# Altium schematic sheet 5V输出.SchDoc
size A4
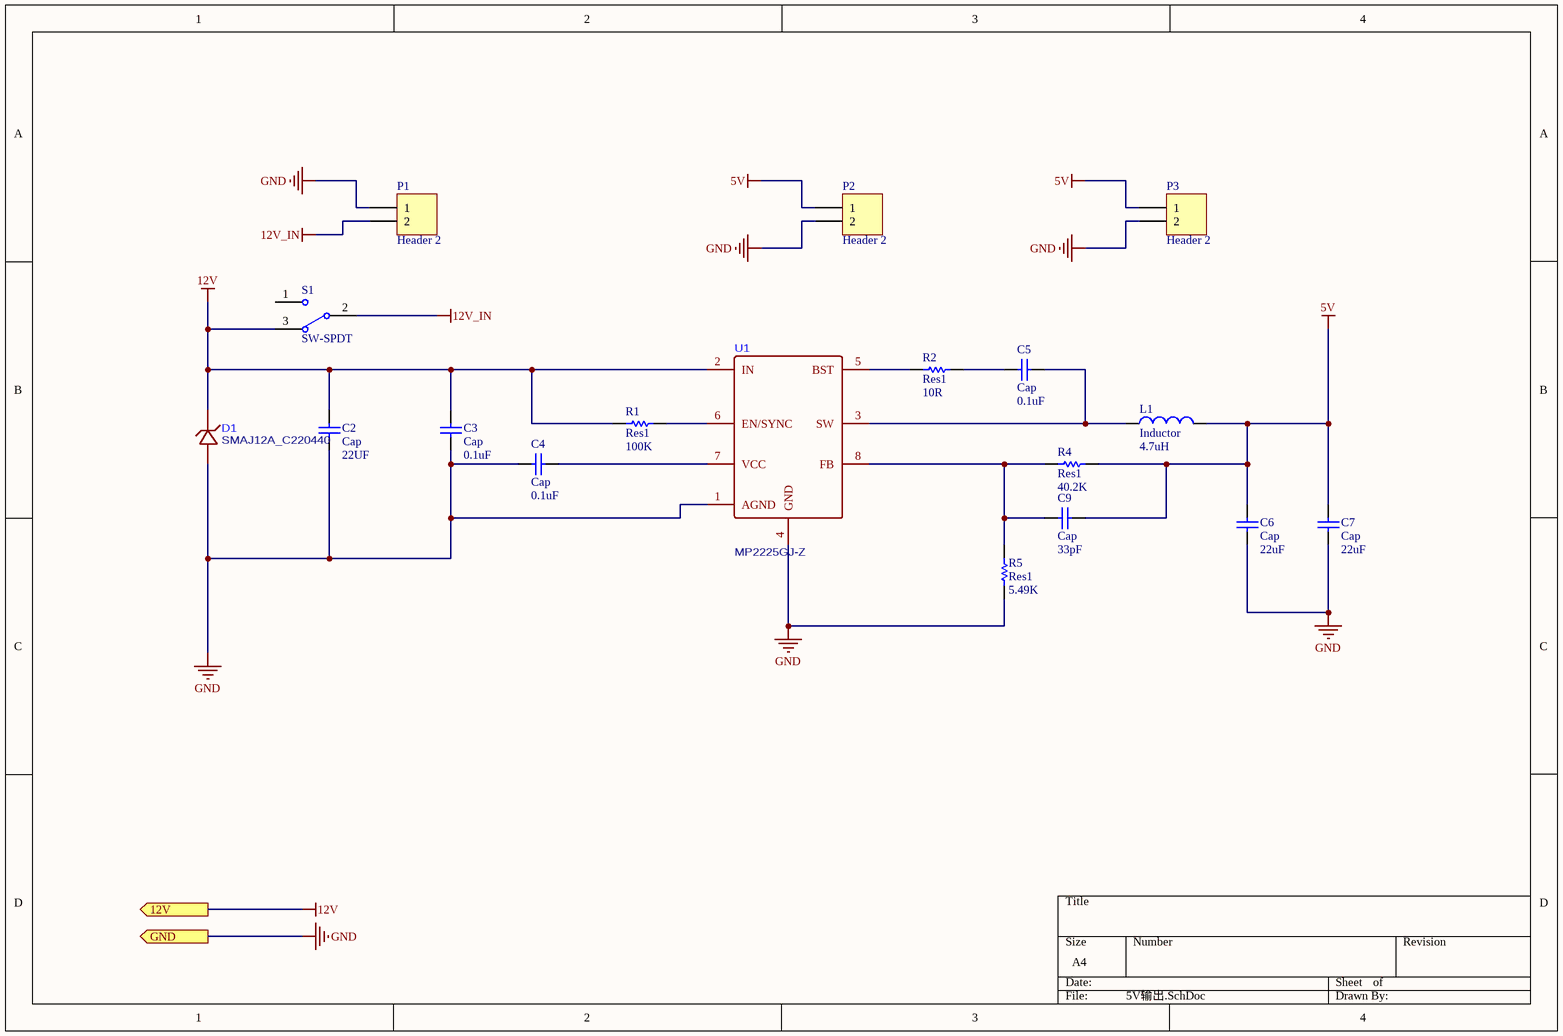
[diagram p0: 5V输出.SchDoc]

## Parts
C2  Cap  value 22UF  [C1206]
C3  Cap  value 0.1uF  [R0603]
C4  Cap  value 0.1uF  [R0603]
C5  Cap  value 0.1uF  [R0603]
C6  Cap  value 22uF  [C0805]
C7  Cap  value 22uF  [C0805]
C9  Cap  value 33pF  [R0603]
D1  SMAJ12A_C220440  [SMA_L4.4-W2.8-LS5.4-RD]
L1  Inductor  value 4.7uH  [IND-SMD_L7.8-W7.0_MAPM0630F]
P1  Header 2  [CONN-TH_XT30UPB-M]
P2  Header 2  [XH2.54-2A]
P3  Header 2  [XH2.54-2A]
R1  Res1  value 100K  [R0603]
R2  Res1  value 10R  [R0603]
R4  Res1  value 40.2K  [R0603]
R5  Res1  value 5.49K  [R0603]
S1  SW-SPDT  [PCBComponent_1 - duplicate]
U1  MP2225GJ-Z  [TSOT-23-8_L2.9-W1.6-P0.65-LS2.8-BR]

## Ports
12V (out), GND (out)

## Nets
5V: C6.2 C7.2 C9.2 L1.2 P2.1 P3.1 R4.2
12V: C2.2 C3.2 D1.1 R1.1 S1.3 U1.2(IN) ; port 12V
12V_IN: P1.2 S1.2
GND: C2.1 C3.1 C4.1 C6.1 C7.1 D1.2 P1.1 P2.2 P3.2 R5.1 U1.1(AGND) U1.4(GND) ; port GND
NetC4_2: C4.2 U1.7(VCC)
NetC5_1: C5.1 R2.2
NetC5_2: C5.2 L1.1 U1.3(SW)
NetC9_1: C9.1 R4.1 R5.2 U1.8(FB)
NetR1_2: R1.2 U1.6(EN/SYNC)
NetR2_1: R2.1 U1.5(BST)

Not connected (* = marked no-connect by the designer): S1 1

## Library data of the parts
C2-C7 C9 = Cap: Capacitor; Published: 8-Jun-2000; LatestRevisionDate: 17-Jul-2002; LatestRevisionNote: Re-released for DXP Platform.; PackageReference: RAD-0.3; Publisher: Altium Limited; PackageDescription: Radial Cap, Thru-Hole; 2 Leads; 0.3 in Pin Spacing
L1 = Inductor: Code_IEC: 1005; Published: 8-Jun-2000; LatestRevisionDate: 29-May-2009; LatestRevisionNote: IPC-7351 Footprint Added.; PackageReference: 0402-A; Publisher: Altium Limited; PackageDescription: Chip Inductor; Code_JEITA: 0402
P1-P3 = Header 2: Header, 2-Pin; LatestRevisionDate: 17-Jul-2002; LatestRevisionNote: Re-released for DXP Platform.; Publisher: Altium Limited
R1 R2 R4 R5 = Res1: Resistor; Published: 8-Jun-2000; LatestRevisionDate: 17-Jul-2002; LatestRevisionNote: Re-released for DXP Platform.; PackageReference: AXIAL-0.3; Publisher: Altium Limited; PackageDescription: Axial Device, Thru-Hole; 2 Leads; 0.3 in Pin Spacing
S1 = SW-SPDT: SPDT Subminiature Toggle Switch, Right Angle Mounting, Vertical Actuation; Published: 24-Mar-1999; LatestRevisionDate: 17-Dec-2003; LatestRevisionNote: Schematic revised, PCB Footprint replaced.; DatasheetVersion: 05-Dec-2000; PackageReference: TL36WW15050; Publisher: Altium Limited; PackageDescription: Switch; 4 Leads; ComponentLink1Description: Manufacturer Link; ComponentLink1URL: http://www.apem.com